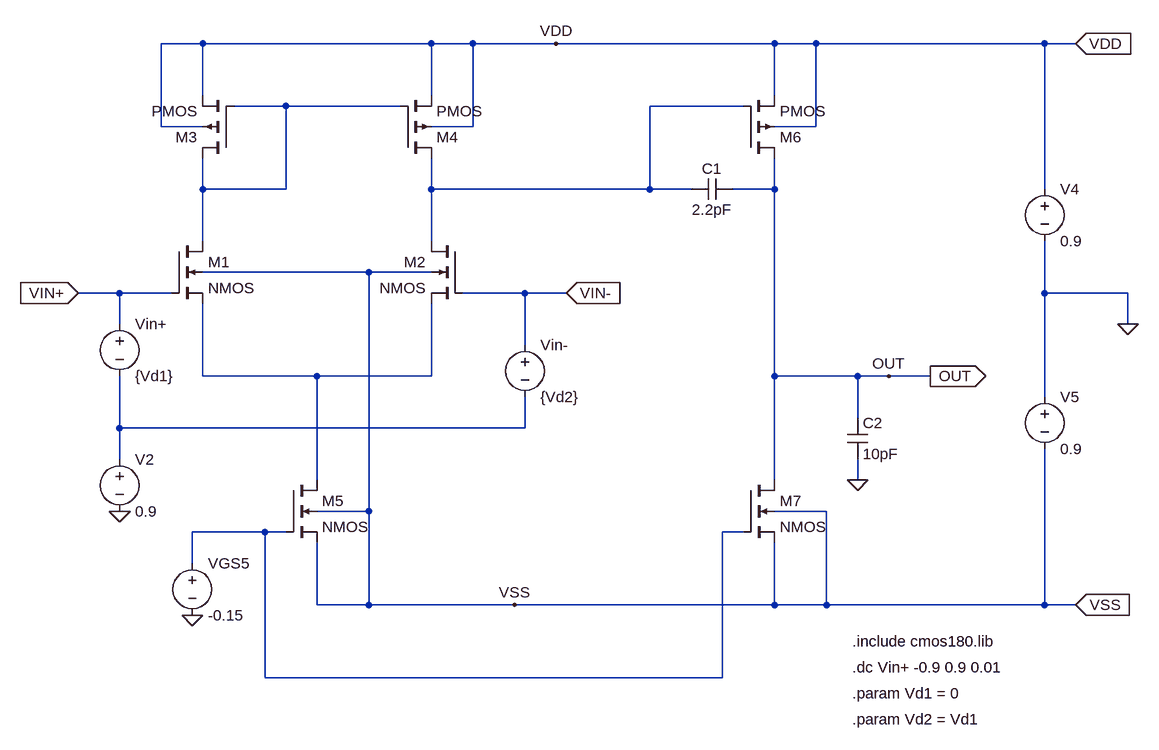
[diagram p0: schematic VoutRange_TB.asc]
VoutRange_TB.asc, the LTspice schematic file:
Version 4
SHEET 1 2716 692
WIRE 160 -400 96 -400
WIRE 512 -400 160 -400
WIRE 576 -400 512 -400
WIRE 704 -400 576 -400
WIRE 1040 -400 704 -400
WIRE 1104 -400 1040 -400
WIRE 1456 -400 1104 -400
WIRE 1504 -400 1456 -400
WIRE 160 -320 160 -400
WIRE 512 -320 512 -400
WIRE 1040 -320 1040 -400
WIRE 288 -304 208 -304
WIRE 464 -304 288 -304
WIRE 992 -304 848 -304
WIRE 96 -272 96 -400
WIRE 160 -272 96 -272
WIRE 576 -272 576 -400
WIRE 576 -272 512 -272
WIRE 1104 -272 1104 -400
WIRE 1104 -272 1040 -272
WIRE 160 -176 160 -224
WIRE 288 -176 288 -304
WIRE 288 -176 160 -176
WIRE 512 -176 512 -224
WIRE 848 -176 848 -304
WIRE 848 -176 512 -176
WIRE 912 -176 848 -176
WIRE 1040 -176 1040 -224
WIRE 1040 -176 976 -176
WIRE 1456 -176 1456 -400
WIRE 160 -96 160 -176
WIRE 512 -96 512 -176
WIRE 416 -48 160 -48
WIRE 512 -48 416 -48
WIRE 32 -16 -32 -16
WIRE 112 -16 32 -16
WIRE 656 -16 560 -16
WIRE 720 -16 656 -16
WIRE 1456 -16 1456 -96
WIRE 1584 -16 1456 -16
WIRE 32 32 32 -16
WIRE 1584 32 1584 -16
WIRE 656 64 656 -16
WIRE 160 112 160 0
WIRE 336 112 160 112
WIRE 512 112 512 0
WIRE 512 112 336 112
WIRE 1040 112 1040 -176
WIRE 1168 112 1040 112
WIRE 1216 112 1168 112
WIRE 1280 112 1216 112
WIRE 1456 144 1456 -16
WIRE 1168 176 1168 112
WIRE 32 192 32 112
WIRE 656 192 656 144
WIRE 656 192 32 192
WIRE 32 240 32 192
WIRE 336 272 336 112
WIRE 1040 272 1040 112
WIRE 1168 272 1168 240
WIRE 416 320 416 -48
WIRE 416 320 336 320
WIRE 1120 320 1040 320
WIRE 256 352 144 352
WIRE 288 352 256 352
WIRE 992 352 960 352
WIRE 144 400 144 352
WIRE 336 464 336 368
WIRE 416 464 416 320
WIRE 416 464 336 464
WIRE 640 464 416 464
WIRE 1040 464 1040 368
WIRE 1040 464 640 464
WIRE 1120 464 1120 320
WIRE 1120 464 1040 464
WIRE 1456 464 1456 224
WIRE 1456 464 1120 464
WIRE 1504 464 1456 464
WIRE 256 576 256 352
WIRE 960 576 960 352
WIRE 960 576 256 576
FLAG 640 464 VSS
FLAG 704 -400 VDD
FLAG 1504 -400 VDD
IOPIN 1504 -400 In
FLAG 1504 464 VSS
IOPIN 1504 464 In
FLAG 1216 112 OUT
FLAG 1280 112 OUT
IOPIN 1280 112 Out
FLAG -32 -16 VIN+
IOPIN -32 -16 In
FLAG 720 -16 VIN-
IOPIN 720 -16 In
FLAG 1168 272 0
FLAG 1584 32 0
FLAG 32 320 0
FLAG 144 480 0
SYMBOL pmos4 208 -224 R180
SYMATTR InstName M3
SYMATTR Value2 l=0.5u w=2.2u
SYMBOL nmos4 560 -96 M0
SYMATTR InstName M2
SYMATTR Value2 l=0.5u w=10u
SYMBOL nmos4 112 -96 R0
SYMATTR InstName M1
SYMATTR Value2 l=0.5u w=10u
SYMBOL pmos4 464 -224 M180
SYMATTR InstName M4
SYMATTR Value2 l=0.5u w=2.2u
SYMBOL nmos4 288 272 R0
SYMATTR InstName M5
SYMATTR Value2 l=0.5u w=1.8u
SYMBOL pmos4 992 -224 M180
SYMATTR InstName M6
SYMATTR Value2 l=0.5u w=100u
SYMBOL nmos4 992 272 R0
SYMATTR InstName M7
SYMATTR Value2 l=0.5u w=40u
SYMBOL cap 976 -192 R90
WINDOW 0 0 32 VBottom 2
WINDOW 3 32 32 VTop 2
SYMATTR InstName C1
SYMATTR Value 2.2pF
SYMBOL voltage 32 16 R0
WINDOW 123 24 124 Left 2
WINDOW 39 0 0 Left 2
SYMATTR InstName Vin+
SYMATTR Value {Vd1}
SYMBOL voltage 656 48 R0
WINDOW 123 24 124 Left 2
WINDOW 39 0 0 Left 2
SYMATTR InstName Vin-
SYMATTR Value {Vd2}
SYMBOL cap 1152 176 R0
SYMATTR InstName C2
SYMATTR Value 10pF
SYMBOL voltage 1456 -192 R0
WINDOW 123 0 0 Left 2
WINDOW 39 0 0 Left 2
SYMATTR InstName V4
SYMATTR Value 0.9
SYMBOL voltage 1456 128 R0
WINDOW 123 0 0 Left 2
WINDOW 39 0 0 Left 2
SYMATTR InstName V5
SYMATTR Value 0.9
SYMBOL voltage 32 224 R0
WINDOW 123 0 0 Left 2
WINDOW 39 0 0 Left 2
SYMATTR InstName V2
SYMATTR Value 0.9
SYMBOL voltage 144 384 R0
WINDOW 123 0 0 Left 2
WINDOW 39 0 0 Left 2
SYMATTR InstName VGS5
SYMATTR Value -0.15
TEXT 1160 520 Left 2 !.include cmos180.lib
TEXT 1160 600 Left 2 !.param Vd1 = 0
TEXT 1160 640 Left 2 !.param Vd2 = Vd1
TEXT 1160 560 Left 2 !.dc Vin+ -0.9 0.9 0.01

The netlist it stands for:
* VoutRange_TB.asc
M3 N001 N001 VDD VDD PMOS l=0.5u w=2.2u
M2 N002 VIN- N003 VSS NMOS l=0.5u w=10u
M1 N001 VIN+ N003 VSS NMOS l=0.5u w=10u
M4 N002 N001 VDD VDD PMOS l=0.5u w=2.2u
M5 N003 N005 VSS VSS NMOS l=0.5u w=1.8u
M6 OUT N002 VDD VDD PMOS l=0.5u w=100u
M7 OUT N005 VSS VSS NMOS l=0.5u w=40u
C1 OUT N002 2.2pF
Vin+ VIN+ N004 {Vd1}
Vin- VIN- N004 {Vd2}
C2 OUT 0 10pF
V4 VDD 0 0.9
V5 0 VSS 0.9
V2 N004 0 0.9
VGS5 N005 0 -0.15
.model NMOS NMOS
.model PMOS PMOS
.lib standard.mos
.include cmos180.lib
.param Vd1 = 0
.param Vd2 = Vd1
.dc Vin+ -0.9 0.9 0.01
.backanno
.end

* Results of the author's LTspice run, read from the files saved beside the schematic
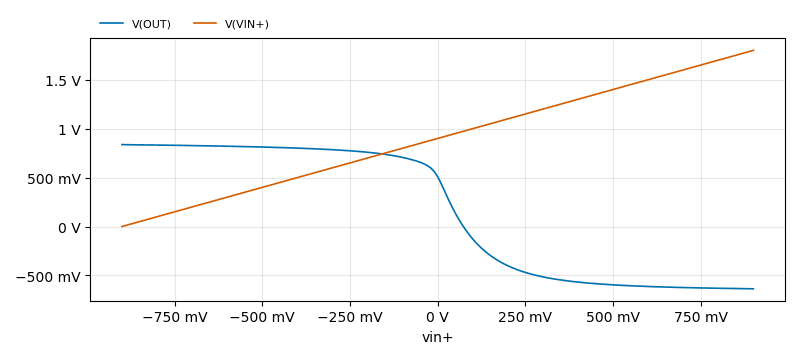
[diagram p1: DC transfer characteristic of VoutRange_TB.asc, plotted from the saved traces]
* DC transfer characteristic, 1 run:
*   V(OUT): 836.8 mV at vin+=-900 mV, -636.3 mV at vin+=900 mV, min -636.3 mV, max 836.8 mV
*   V(VIN+): 0 V at vin+=-900 mV, 1.8 V at vin+=900 mV, min 0 V, max 1.8 V